# EasyEDA Pro project ProPrj_cap banks_2026-02-15.epro, board PCB1_2
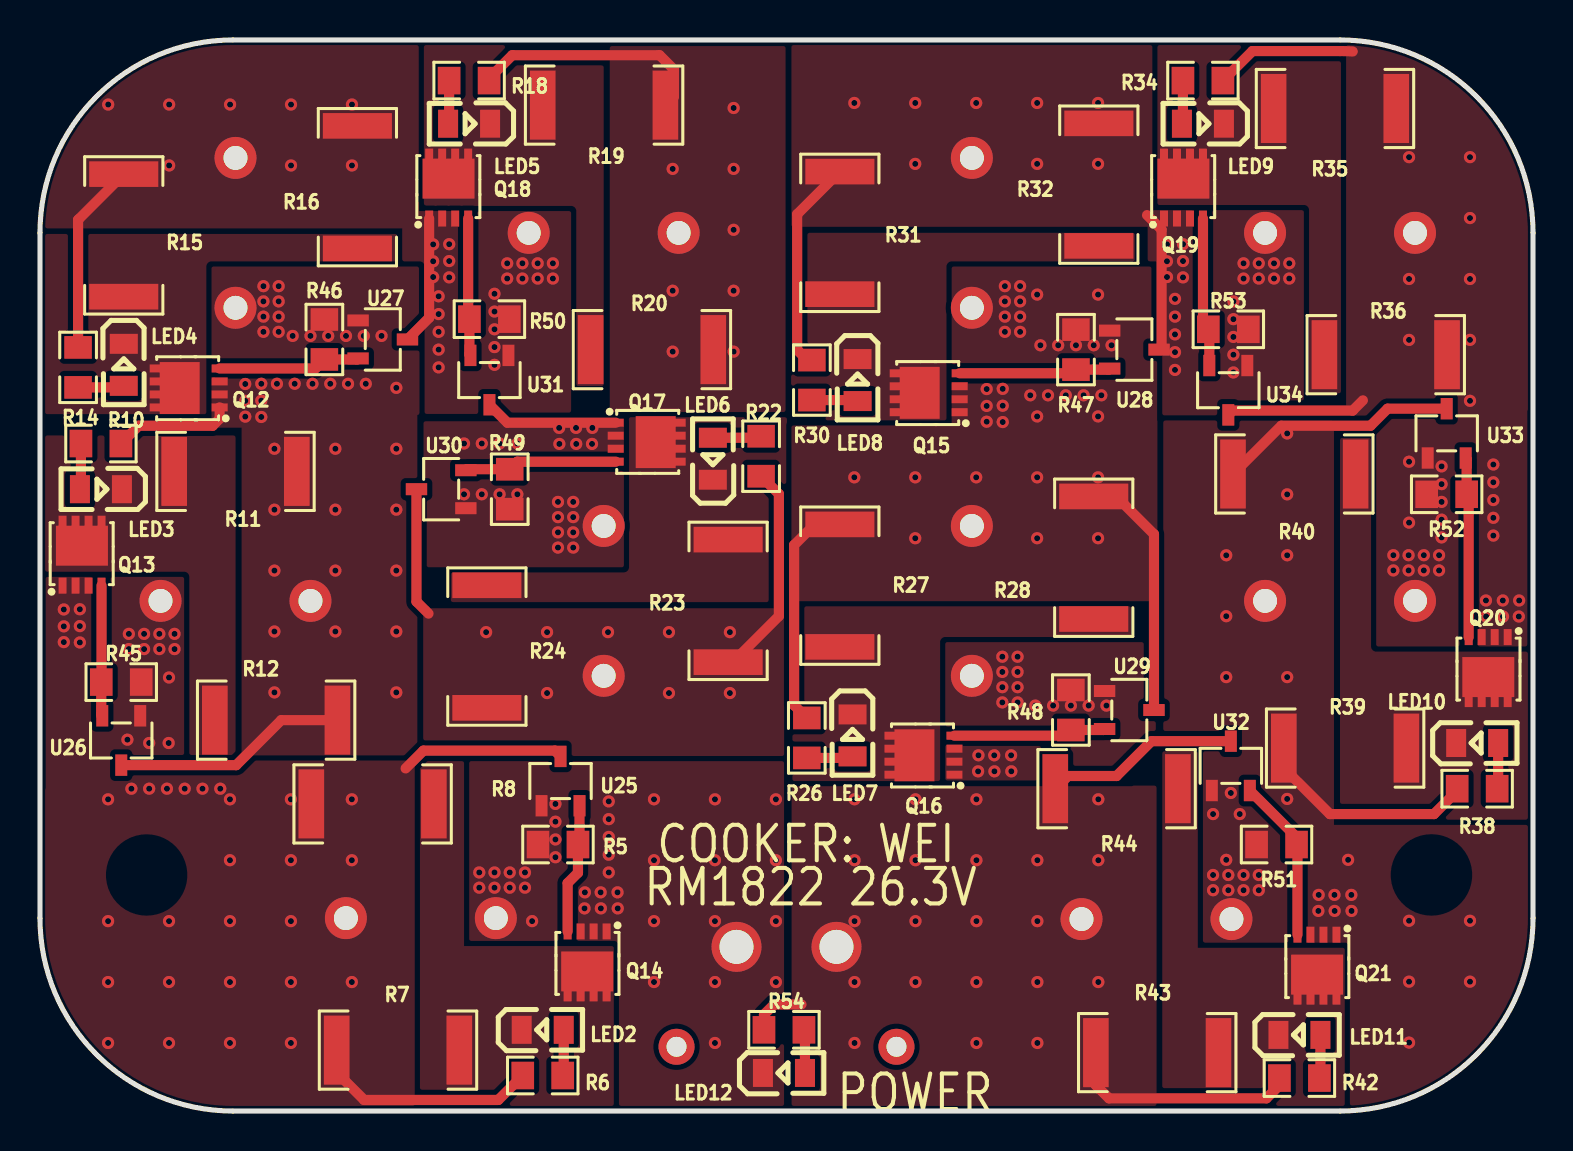
[diagram p8: board, top side]
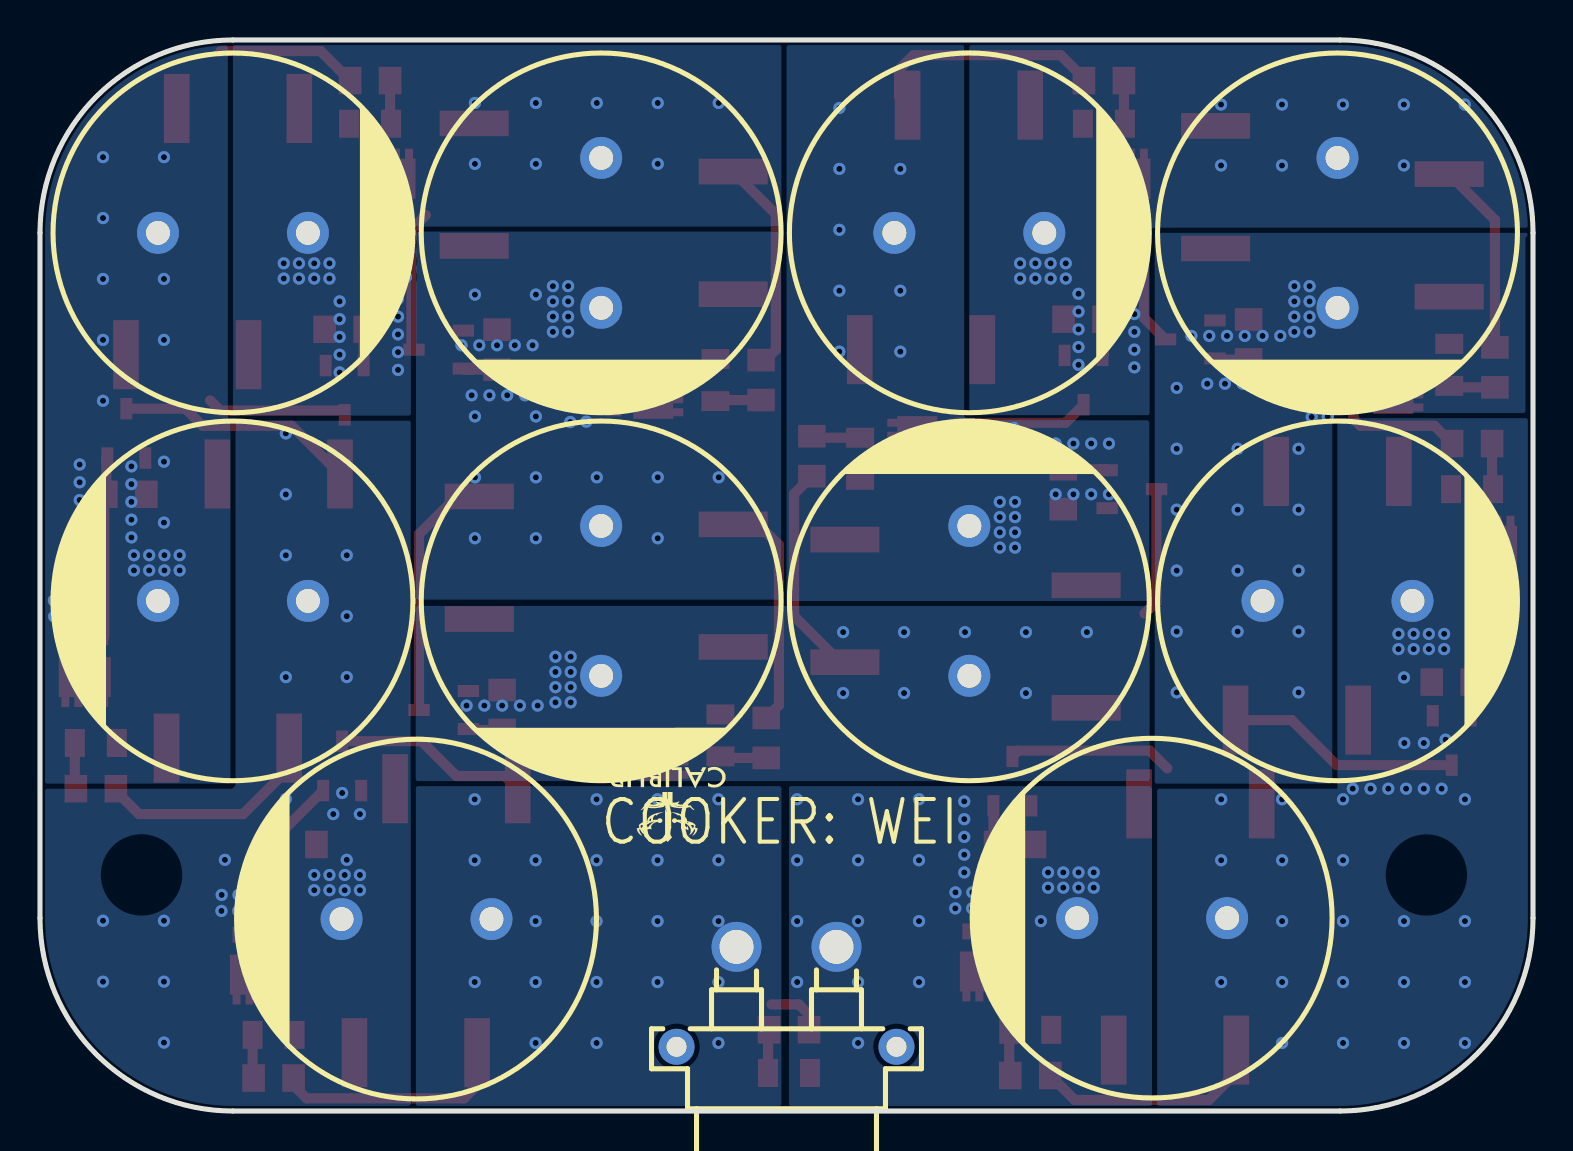
[diagram p9: board, bottom side, seen from below]

Outline 74.68 x 53.59 mm; copper layers: Top Layer, Bottom Layer. Coordinates in mm from the lower left corner of the outline.
Outline path: 0,43.94 0,9.65 arc(2.83,2.83) 9.65,0 65.02,0 arc(71.85,2.83) 74.68,9.65 74.68,43.94 arc(71.85,50.77) 65.02,53.59 9.65,53.59 arc(2.83,50.77) 0,43.94
Stack: Top Layer 0.035mm / Dielectric1 1.51mm FR4 er 4.5 / Bottom Layer 0.035mm

## Design rules (mm)
template: Custom Config
spacing copperThickness1oz (default): track to track 0.102, other pairs 0.152 to 0.3
spacing copperThickness2oz: track to track 0.203, other pairs 0.152 to 0.3
track width copperThickness1oz (default): min 0.127, default 0.508, max 2.54
track width copperThickness2oz: min 0.203, default 0.254, max 2.54
differential pair differentialPair (default): width min 0.127, default 0.254, max 2.54; gap min 0.152, default 0.152
via viaSize (default): diameter min 0.5, default 0.61, max 10; hole min 0.3, default 0.305, max 6.3
net GND uses copperRegion1
net $1N2021 uses copperRegion1
net $1N2373 uses copperRegion1
net $1N2722 uses copperRegion1
net $1N3071 uses copperRegion1
net $1N3399 uses copperRegion1
net $1N3727 uses copperRegion1
net $1N4055 uses copperRegion1
net $1N4383 uses copperRegion1
net $1N4711 uses copperRegion1
net $1N5039 uses copperRegion1
net $1N3072 uses copperRegion1
net VCC uses copperRegion1
net NET2 uses copperRegion1
net NET3 uses copperRegion1
net NET4 uses copperRegion1
net NET5 uses copperRegion1
net NET6 uses copperRegion1
net NET7 uses copperRegion1
net NET8 uses copperRegion1
net NET9 uses copperRegion1
net NET10 uses copperRegion1

## Placement (name value [footprint] x y rotation side)
LED2  NCD0805R1  [LED0805-R-RD]  25.15 4.06 0 top
LED3  NCD0805R1  [LED0805-R-RD]  3.05 31.11 180 top
LED4  NCD0805R1  [LED0805-R-RD]  4.19 37.34 270 top
LED5  NCD0805R1  [LED0805-R-RD]  21.46 49.4 180 top
LED6  NCD0805R1  [LED0805-R-RD]  33.66 32.64 90 top
LED7  NCD0805R1  [LED0805-R-RD]  40.64 18.8 270 top
LED8  NCD0805R1  [LED0805-R-RD]  40.89 36.58 270 top
LED9  NCD0805R1  [LED0805-R-RD]  58.17 49.4 180 top
LED10  NCD0805R1  [LED0805-R-RD]  71.88 18.41 0 top
LED11  NCD0805R1  [LED0805-R-RD]  62.99 3.81 0 top
LED12  KT-0805G  [LED0805-R-RD]  37.21 1.91 0 top
Q12  AP2045Q  [DFN-8_L3.1-W3.0-P0.65-LS3.3-BL]  7.44 36.18 90 top
Q13  AP2045Q  [DFN-8_L3.1-W3.0-P0.65-LS3.3-BL]  2.1 27.84 0 top
Q14  AP2045Q  [DFN-8_L3.1-W3.0-P0.65-LS3.3-BL]  27.37 7.44 180 top
Q15  AP2045Q  [DFN-8_L3.1-W3.0-P0.65-LS3.3-BL]  44.45 35.94 90 top
Q16  AP2045Q  [DFN-8_L3.1-W3.0-P0.65-LS3.3-BL]  44.19 17.81 90 top
Q17  AP2045Q  [DFN-8_L3.1-W3.0-P0.65-LS3.3-BL]  30.35 33.47 270 top
Q18  AP2045Q  [DFN-8_L3.1-W3.0-P0.65-LS3.3-BL]  20.44 46.21 0 top
Q19  AP2045Q  [DFN-8_L3.1-W3.0-P0.65-LS3.3-BL]  57.19 46.21 0 top
Q20  AP2045Q  [DFN-8_L3.1-W3.0-P0.65-LS3.3-BL]  72.43 22.16 180 top
Q21  AP2045Q  [DFN-8_L3.1-W3.0-P0.65-LS3.3-BL]  63.87 7.28 180 top
R5  30kΩ  [R0805]  25.91 13.33 0 top
R6  100Ω  [R0805]  25.15 1.78 180 top
R7  1Ω  [R2512]  17.91 3.05 180 top
R8  1Ω  [R2512]  16.64 15.37 180 top
R10  100Ω  [R0805]  3.05 33.4 0 top
R11  1Ω  [R2512]  9.78 32.01 0 top
R12  1Ω  [R2512]  11.81 19.56 0 top
R14  100Ω  [R0805]  1.91 37.21 90 top
R15  1Ω  [R2512]  4.19 43.81 90 top
R16  1Ω  [R2512]  15.88 46.23 90 top
R18  100Ω  [R0805]  21.46 51.56 0 top
R19  1Ω  [R2512]  28.21 50.34 0 top
R20  1Ω  [R2512]  30.61 38.1 0 top
R22  100Ω  [R0805]  36.07 32.77 270 top
R23  1Ω  [R2512]  34.42 25.53 270 top
R24  1Ω  [R2512]  22.35 23.24 270 top
R26  100Ω  [R0805]  38.35 18.67 90 top
R27  1Ω  [R2512]  40.01 26.29 90 top
R28  1Ω  [R2512]  52.7 27.69 90 top
R30  100Ω  [R0805]  38.61 36.58 90 top
R31  1Ω  [R2512]  40.01 43.94 90 top
R32  1Ω  [R2512]  52.96 46.35 90 top
R34  100Ω  [R0805]  58.17 51.56 0 top
R35  1Ω  [R2512]  64.77 50.16 0 top
R36  1Ω  [R2512]  67.31 37.85 0 top
R38  100Ω  [R0805]  71.88 16.13 180 top
R39  1Ω  [R2512]  65.28 18.16 180 top
R40  1Ω  [R2512]  62.74 31.88 180 top
R42  100Ω  [R0805]  62.99 1.65 180 top
R43  1Ω  [R2512]  55.88 2.92 180 top
R44  1Ω  [R2512]  53.85 16.13 180 top
R45  30kΩ  [R0805]  4.06 21.46 180 top
R46  30kΩ  [R0805]  14.22 38.61 270 top
R47  30kΩ  [R0805]  51.82 38.1 270 top
R48  30kΩ  [R0805]  51.56 20.07 270 top
R49  30kΩ  [R0805]  23.49 31.11 90 top
R50  30kΩ  [R0805]  22.48 39.62 180 top
R51  30kΩ  [R0805]  61.85 13.33 0 top
R52  30kΩ  [R0805]  70.36 30.86 0 top
R53  30kΩ  [R0805]  59.44 39.12 180 top
R54  30kΩ  [R0805]  37.21 4.06 180 top
U1  XT30PW-F20.G.Y  [CONN-TH_XT30PW-F-1]  37.34 5.71 180 bottom
U5  1500uF  [CAP-TH_BD18.0-P7.50-D0.8-FD]  19.05 9.65 0 bottom
U7  1500uF  [CAP-TH_BD18.0-P7.50-D0.8-FD]  9.78 25.53 180 bottom
U9  1500uF  [CAP-TH_BD18.0-P7.50-D0.8-FD]  9.78 43.94 270 bottom
U11  1500uF  [CAP-TH_BD18.0-P7.50-D0.8-FD]  28.19 43.94 180 bottom
U13  1500uF  [CAP-TH_BD18.0-P7.50-D0.8-FD]  28.19 25.53 90 bottom
U15  1500uF  [CAP-TH_BD18.0-P7.50-D0.8-FD]  46.61 25.53 270 bottom
U17  1500uF  [CAP-TH_BD18.0-P7.50-D0.8-FD]  46.61 43.94 270 bottom
U19  1500uF  [CAP-TH_BD18.0-P7.50-D0.8-FD]  65.02 43.94 180 bottom
U21  1500uF  [CAP-TH_BD18.0-P7.50-D0.8-FD]  65.02 25.53 0 bottom
U23  1500uF  [CAP-TH_BD18.0-P7.50-D0.8-FD]  55.84 9.6 0 bottom
U25  LN809C2641MR-G  [SOT-23-3_L2.9-W1.6-P1.90-LS2.8-BR]  26.04 16.51 270 top
U26  LN809C2641MR-G  [SOT-23-3_L2.9-W1.6-P1.90-LS2.8-BR]  4.06 18.54 90 top
U27  LN809C2641MR-G  [SOT-23-3_L2.9-W1.6-P1.90-LS2.8-BR]  17.14 38.61 180 top
U28  LN809C2641MR-G  [SOT-23-3_L2.9-W1.6-P1.90-LS2.8-BR]  54.74 38.1 180 top
U29  LN809C2641MR-G  [SOT-23-3_L2.9-W1.6-P1.90-LS2.8-BR]  54.48 20.07 180 top
U30  LN809C2641MR-G  [SOT-23-3_L2.9-W1.6-P1.90-LS2.8-BR]  20.07 31.11 0 top
U31  LN809C2641MR-G  [SOT-23-3_L2.9-W1.6-P1.90-LS2.8-BR]  22.48 36.58 90 top
U32  LN809C2641MR-G  [SOT-23-3_L2.9-W1.6-P1.90-LS2.8-BR]  59.56 17.27 270 top
U33  LN809C2641MR-G  [SOT-23-3_L2.9-W1.6-P1.90-LS2.8-BR]  70.36 33.91 270 top
U34  LN809C2641MR-G  [SOT-23-3_L2.9-W1.6-P1.90-LS2.8-BR]  59.44 36.07 90 top

## Footprints (pads in the part's own frame, mm; a bottom-side part is the same pattern mirrored in y, then rotated)
CAP-TH_BD18.0-P7.50-D0.8-FD
  round 2.1 hole 1.2: 1(-3.75,0) 2(3.75,0)
CONN-TH_XT30PW-F-1
  round 2.5 hole 1.7: 1(-2.5,2.5) 2(2.5,2.5)
  round 1.8 hole 1: 3(5.5,-2.5) 4(-5.5,-2.5)
DFN-8_L3.1-W3.0-P0.65-LS3.3-BL
  rect 0.4x0.8 smd: 1(-0.975,-1.55) 2(-0.325,-1.55) 3(0.326,-1.55) 4(0.975,-1.55) 5(0.975,1.55) 6(0.325,1.55) 7(-0.325,1.55) 8(-0.975,1.55)
  rect 2.6x2 smd: 8(-0.004,0.45)
LED0805-R-RD
  rect 1x1.399 smd: 1(1.05,0) 2(-1.05,0)
R0805
  rect 1.133x1.377 smd: 1(-1,0) 2(1,0)
R2512
  rect 1.282x3.456 smd: 1(-3.067,0) 2(3.067,0)
SOT-23-3_L2.9-W1.6-P1.90-LS2.8-BR
  rect 1.07x0.6 smd: 1(1.235,-0.95) 2(1.235,0.95) 3(-1.235,0)

## Nets
As in the schematic.

Pads without a net: U1 3 4

## Via types
v1: diameter 0.61, hole 0.305, Top Layer to Bottom Layer, 366 vias

## Routing (per net, layer and track width the routed paths; a pad name or vN(x,y) marks a point on that pad's centre or on a via; arc(x,y) is an arc through that point)
GND:
  vias: v1(21.97,11.94) v1(21.97,11.18) v1(22.73,11.94) v1(22.73,11.18) v1(23.49,11.94) v1(23.49,11.18) v1(24.26,11.94) v1(24.26,11.18) v1(24.61,9.5) v1(25.78,15.37) v1(25.78,14.48) v1(25.78,13.59) v1(25.78,12.7) v1(27.24,10.14) v1(27.25,10.94) v1(28.04,10.94) v1(28.05,10.14) v1(28.45,15.49) v1(28.45,14.6) v1(28.45,13.72) v1(28.45,12.83) v1(28.45,11.94) v1(28.89,10.94) v1(28.9,10.14) v1(30.71,15.6) v1(30.71,12.55) v1(30.71,9.5) v1(30.71,6.45) v1(33.76,15.6) v1(33.76,12.55) v1(33.76,9.5) v1(33.76,6.45) v1(33.76,3.41) v1(36.81,15.6) v1(36.81,12.55) v1(36.81,9.5) v1(36.81,6.45)
VCC: length 24.3
  Top Layer w0.508: R43.2 52.81,1.29 53.47,0.63 61.34,0.63 61.99,1.29 R42.2 ; 38.08,5.33 36.72,5.33 36.21,4.83 R54.2 ; R44.2 51.42,16.76 53.85,16.76 55.59,18.51 U32.3
  vias: v1(40.74,15.6) v1(40.74,12.55) v1(40.74,9.5) v1(40.74,6.45) v1(40.74,3.41) v1(43.79,15.6) v1(43.79,12.55) v1(43.79,9.5) v1(43.79,6.45) v1(46.84,15.6) v1(46.84,12.55) v1(46.84,9.5) v1(46.84,6.45) v1(46.84,3.41) v1(49.89,12.55) v1(49.89,9.5) v1(49.89,6.45) v1(49.89,3.41) v1(52.93,15.6) v1(52.93,12.55) v1(52.93,6.45)
NET2: length 19.7
  Top Layer w0.508: U25.3 25.75,18.03 19.18,18.03 18.29,17.14 ; R7.2 14.84,1.92 16.21,0.55 22.92,0.55 R6.2
  vias: v1(1.19,25.1) v1(1.19,24.25) v1(1.19,23.46) v1(1.99,25.11) v1(1.99,24.26) v1(1.99,23.45) v1(3.41,15.6) v1(3.41,9.5) v1(3.41,6.45) v1(3.41,3.41) v1(4.37,18.58) v1(4.45,23.88) v1(4.45,23.11) v1(4.57,16.13) v1(5.21,23.88) v1(5.21,23.11) v1(5.46,18.41) v1(5.46,16.13) v1(5.97,23.88) v1(5.97,23.11) v1(6.44,18.41) v1(6.35,16.13) v1(6.45,21.69) v1(6.45,9.5) v1(6.45,6.45) v1(6.45,3.41) v1(6.73,23.88) v1(6.73,23.11) v1(7.24,16.13) v1(8.13,16.13) v1(9.02,16.13) v1(9.5,15.6) v1(9.5,12.55) v1(9.5,9.5) v1(9.5,6.45) v1(9.5,3.41) v1(12.55,15.6) v1(12.55,12.55) v1(12.55,9.5) v1(12.55,6.45) v1(12.55,3.41) v1(15.6,15.6) v1(15.6,12.55) v1(15.6,6.45)
NET3: length 17.8
  Top Layer w0.508: U26.3 9.81,17.31 12.07,19.56 R12.2 ; R10.2 4.94,34.29 8.64,34.29 8.99,34.64 Q12.1
  vias: v1(10.27,36.38) v1(10.27,35.54) v1(10.27,34.75) v1(11.07,36.39) v1(11.07,35.55) v1(11.07,34.73) v1(11.18,41.27) v1(11.18,40.51) v1(11.18,39.75) v1(11.18,38.99) v1(11.73,33.14) v1(11.73,30.09) v1(11.73,27.04) v1(11.73,23.99) v1(11.73,20.95) v1(11.94,41.27) v1(11.94,40.51) v1(11.94,39.75) v1(11.94,38.99) v1(11.85,36.39) v1(12.64,38.79) v1(12.74,36.39) v1(13.53,38.79) v1(13.63,36.39) v1(14.42,38.79) v1(14.52,36.39) v1(14.77,33.14) v1(14.77,30.09) v1(14.77,27.04) v1(14.77,23.99) v1(15.31,38.79) v1(15.41,36.39) v1(16.2,38.79) v1(16.3,36.39) v1(17.08,38.79) v1(17.82,36.19) v1(17.82,33.14) v1(17.82,30.09) v1(17.82,27.04) v1(17.82,23.99) v1(17.82,20.95)
NET4: length 16.1
  Top Layer w0.508: R15.2 1.91,44.6 R14.2 ; U27.3 19.47,39.69 Q18.1
  vias: v1(3.41,50.36) v1(6.46,50.36) v1(6.46,47.32) v1(9.51,50.36) v1(12.56,50.36) v1(12.56,47.32) v1(15.6,50.36) v1(15.6,47.32) v1(19.67,43.36) v1(19.67,42.52) v1(19.67,41.73) v1(19.94,40.77) v1(19.94,39.88) v1(19.94,38.99) v1(19.94,38.1) v1(19.94,37.21) v1(20.47,43.38) v1(20.47,42.53) v1(20.47,41.71) v1(22.73,40.89) v1(22.73,40) v1(22.73,39.12) v1(22.73,38.23) v1(22.73,37.34) v1(23.37,42.42) v1(23.37,41.66) v1(24.13,42.42) v1(24.13,41.66) v1(24.89,42.42) v1(24.89,41.66) v1(25.65,42.42) v1(25.65,41.66)
NET5: length 18.8
  Top Layer w0.508: U31.3 23.38,34.44 Q17.1 ; R19.2 31.71,50.76 31.71,52.11 30.99,52.83 23.62,52.83 22.46,51.67 R18.2
  vias: v1(21.21,33.4) v1(21.21,30.86) v1(22.1,33.4) v1(22.1,30.86) v1(22.99,33.4) v1(22.99,30.86) v1(23.88,33.4) v1(23.88,30.86) v1(25.91,30.48) v1(25.91,29.72) v1(25.91,28.96) v1(25.91,28.19) v1(25.97,34.18) v1(25.98,33.38) v1(26.67,30.48) v1(26.67,29.72) v1(26.67,28.96) v1(26.67,28.19) v1(26.81,34.18) v1(26.82,33.38) v1(27.63,34.18) v1(27.61,33.38) v1(31.65,47.14) v1(31.65,41.05) v1(31.65,38) v1(34.69,50.19) v1(34.69,47.14) v1(34.69,44.09) v1(34.69,41.05) v1(34.69,38)
NET6: length 17.3
  Top Layer w0.508: 19.43,24.89 18.83,25.49 U30.3 ; R22.2 36.96,30.88 36.96,24.77 34.65,22.46 R23.2
  vias: v1(22.31,23.96) v1(25.36,23.96) v1(25.36,20.91) v1(28.41,23.96) v1(31.46,23.96) v1(31.46,20.91) v1(34.51,23.96) v1(34.51,20.91) v1(46.94,17.8) v1(46.92,17) v1(47.73,17.8) v1(47.74,17) v1(48.13,22.73) v1(48.13,21.97) v1(48.13,21.21) v1(48.13,20.45) v1(48.57,17.8) v1(48.58,17) v1(48.89,22.73) v1(48.89,21.97) v1(48.89,21.21) v1(48.89,20.45) v1(49.78,20.29) v1(50.67,20.29) v1(51.56,20.29) v1(52.45,20.29) v1(53.34,20.29)
NET7: length 24.2
  Top Layer w0.508: R27.2 38.75,29.36 37.72,28.32 37.72,20.3 R26.2 ; U29.3 55.72,28.86 53.83,30.75 R28.2
  vias: v1(40.73,31.71) v1(43.78,31.71) v1(43.78,28.66) v1(46.83,31.71) v1(47.35,36.13) v1(47.35,35.28) v1(47.35,34.49) v1(48.15,36.14) v1(48.15,35.29) v1(48.15,34.48) v1(48.26,41.27) v1(48.26,40.51) v1(48.26,39.75) v1(48.26,38.99) v1(49.02,41.27) v1(49.02,40.51) v1(49.02,39.75) v1(49.02,38.99) v1(49.53,35.81) v1(49.87,40.85) v1(49.87,34.76) v1(49.87,31.71) v1(49.87,28.66) v1(50.04,38.32) v1(50.42,35.81) v1(50.93,38.32) v1(51.31,35.81) v1(51.82,38.32) v1(52.2,35.81) v1(52.7,38.32) v1(52.92,40.85) v1(52.92,34.76) v1(52.92,31.71) v1(52.92,28.66) v1(53.09,35.81) v1(53.59,38.32)
NET8: length 17.8
  Top Layer w0.508: U28.3 56.1,38.23 56.1,44.1 55.37,44.83 ; R31.2 37.87,44.87 37.87,38.08 38.38,37.58 R30.2
  vias: v1(40.73,50.44) v1(43.78,50.44) v1(43.78,47.39) v1(46.83,50.44) v1(49.87,50.44) v1(49.87,47.39) v1(52.92,50.44) v1(52.92,47.39) v1(56.37,43.36) v1(56.37,42.52) v1(56.37,41.73) v1(56.77,40.64) v1(56.77,39.75) v1(56.77,38.86) v1(56.77,37.97) v1(56.77,37.08) v1(57.17,43.38) v1(57.17,42.53) v1(57.17,41.71) v1(59.69,40.51) v1(59.69,39.62) v1(59.69,38.73) v1(59.69,37.85) v1(59.69,36.96) v1(60.2,42.42) v1(60.2,41.66) v1(60.96,42.42) v1(60.96,41.66) v1(61.72,42.42) v1(61.72,41.66) v1(62.48,42.42) v1(62.48,41.66)
NET9: length 14.1
  Top Layer w0.508: U34.3 59.66,35.05 65.66,35.05 66.17,35.56 ; R34.2 60.64,53.04 65.02,53.04 arc(65.34,53.03) 65.66,53.02
  vias: v1(67.69,27.81) v1(67.69,27.05) v1(68.48,47.73) v1(68.48,41.63) v1(68.48,38.59) v1(68.48,32.49) v1(68.48,29.44) v1(68.45,27.81) v1(68.45,27.05) v1(69.21,27.81) v1(69.21,27.05) v1(69.98,27.81) v1(69.98,27.05) v1(70.1,32.26) v1(70.1,31.37) v1(70.1,30.48) v1(70.1,29.59) v1(70.1,28.7) v1(71.52,47.73) v1(71.52,44.68) v1(71.52,41.63) v1(71.52,38.59) v1(71.52,35.54) v1(72.32,25.55) v1(72.33,24.74) v1(72.69,32.35) v1(72.69,31.46) v1(72.69,30.57) v1(72.69,29.68) v1(72.69,28.79) v1(73.17,25.55) v1(73.18,24.74) v1(73.98,25.55) v1(73.97,24.74)
NET10: length 23.3
  Top Layer w0.508: R40.2 62.08,34.29 66.55,34.29 67.4,35.14 U33.3 ; R39.2 62.21,17.16 64.52,14.86 69.72,14.86 70.88,16.02 R38.2
  vias: v1(58.67,14.86) v1(58.67,11.81) v1(58.67,11.05) v1(59.33,27.81) v1(59.33,24.76) v1(59.33,21.71) v1(59.33,12.57) v1(59.44,11.81) v1(59.44,11.05) v1(59.56,15.91) v1(60.01,14.86) v1(60.2,11.81) v1(60.2,11.05) v1(60.96,11.81) v1(60.96,11.05) v1(62.38,33.91) v1(62.38,30.86) v1(62.38,27.81) v1(62.38,21.71) v1(62.38,15.62) v1(63.94,10.01) v1(63.96,10.81) v1(64.75,10.81) v1(64.76,10.01) v1(65.43,12.57) v1(65.59,10.81) v1(65.6,10.01) v1(68.48,9.52) v1(68.48,6.47) v1(68.48,3.42) v1(71.52,9.52) v1(71.52,6.47)
$1N2020: length 2.3
  Top Layer w0.508: LED2.1 26.2,1.83 R6.1
$1N2372: length 2.3
  Top Layer w0.508: R10.1 2.05,31.17 LED3.1
$1N2721: length 2.3
  Top Layer w0.508: R14.1 4.11,36.21 LED4.1
$1N2723: length 7.1
  Top Layer w0.508: U27.2 15.86,37.61 R46.2 13.77,37.16 Q12.4
$1N3070: length 2.2
  Top Layer w0.508: LED5.1 20.46,49.45 R18.1
$1N3072: length 6.9
  Top Layer w0.508: Q18.4 21.42,39.69 R50.2 21.48,37.86 U31.2
$1N3398: length 2.4
  Top Layer w0.508: LED6.1 35.99,33.69 R22.1
$1N3400: length 7.7
  Top Layer w0.508: U30.2 21.35,32.11 R49.2 23.87,32.49 Q17.4
$1N3726: length 2.3
  Top Layer w0.508: LED7.1 40.56,17.67 R26.1
$1N3728: length 7.6
  Top Layer w0.508: Q16.4 51.28,18.78 R48.2 53.2,19.07 U29.2
$1N4054: length 2.3
  Top Layer w0.508: LED8.1 40.84,35.58 R30.1
$1N4056: length 7.6
  Top Layer w0.508: Q15.4 51.63,36.92 R47.2 53.45,37.1 U28.2
$1N4382: length 2.2
  Top Layer w0.508: LED9.1 57.17,49.45 R34.1
$1N4384: length 7.5
  Top Layer w0.508: U34.2 58.49,39.07 R53.2 58.17,39.38 Q19.4
$1N4710: length 2.3
  Top Layer w0.508: R38.1 72.93,16.18 LED10.1
$1N4712: length 9
  Top Layer w0.508: U33.2 71.36,32.62 R52.2 71.46,30.76 Q20.4
$1N5038: length 2.2
  Top Layer w0.508: R42.1 64.04,1.7 LED11.1
$1N5040: length 8.2
  Top Layer w0.508: Q21.4 62.9,13.29 R51.2 62.85,13.7 U32.2
$1N23007: length 6.5
  Top Layer w0.508: U25.2 26.98,13.41 R5.2 26.91,11.92 26.39,11.41 Q14.4
$1N23234: length 6.5
  Top Layer w0.508: Q13.4 3.08,21.48 R45.2 3.06,19.83 U26.2
$1N24721: length 2.2
  Top Layer w0.508: LED12.1 38.26,4.01 R54.1

## Copper pours and planes (outline as drawn; the poured copper is in the pictures)
GND on Top Layer: 19.05,17.53 37.21,17.53 37.21,-0.13 22.35,-0.13 22.35,-0.22 19.05,-0.22
GND on Bottom Layer: 18.76,16.27 37.21,16.27 37.21,-0.38 18.76,-0.38
VCC on Top Layer: 37.59,16.38 55.84,16.38 55.84,-0.61 37.59,-0.61
VCC on Bottom Layer: 37.59,16.26 55.88,16.26 55.88,-0.38 37.59,-0.38
NET2 on Top Layer: 7.21,26.73 7.21,17.54 18.74,17.54 18.74,-0.02 0.18,-0.02 0.18,16.14 0.28,16.14 0.28,26.73
NET2 on Bottom Layer: 18.8,16.13 18.8,0.13 0.25,0.13 0.25,34.67 9.78,34.67 9.78,16.13
NET3 on Top Layer: 18.98,34.83 18.87,34.83 18.87,17.58 10.08,17.58 10.08,34.19 8.58,34.19 8.58,42.26 18.98,42.26
NET3 on Bottom Layer: 18.92,16.38 18.92,43.94 0.13,43.94 0.38,43.69 0.38,34.67 9.91,34.67 9.91,16.34 18.88,16.34
NET4 on Top Layer: 18.11,45.03 26.56,45.03 26.56,34.88 18.11,34.88
NET4 on Top Layer: 0.25,53.34 18.95,53.34 18.95,44.17 0.25,44.17
NET4 on Bottom Layer: 0.25,43.94 0.25,54.48 27.69,54.48 28.19,53.97 28.19,34.82 19.18,34.82 19.18,44.07 0.38,44.07
NET5 on Top Layer: 19.18,27.21 19.18,34.51 29.21,34.51 29.21,27.21
NET5 on Top Layer: 28.5,34.98 28.5,53.29 37.29,53.29 37.29,34.98
NET5 on Bottom Layer: 28.32,53.34 37.34,53.34 37.34,25.53 19.19,25.53 19.19,34.65 19.18,34.67 28.32,43.81
NET6 on Top Layer: 45.28,16.54 45.28,23.46 55.81,23.46 55.81,16.54
NET6 on Top Layer: 37.22,17.77 19.17,17.77 19.17,25.16 37.22,25.16
NET6 on Bottom Layer: 19.05,25.27 55.88,25.27 55.88,16.51 19.05,16.51
NET7 on Top Layer: 55.88,42.26 55.88,34.56 55.89,34.56 55.89,25.51 37.58,25.51 37.58,34.3 45.6,34.3 45.6,42.26
NET7 on Bottom Layer: 37.6,44.01 55.87,44.01 55.87,25.59 37.6,25.59
NET8 on Top Layer: 55.4,45.08 63.22,45.08 63.22,34.67 55.4,34.67
NET8 on Top Layer: 55.64,44.24 37.58,44.24 37.58,53.42 55.64,53.42
NET8 on Bottom Layer: 65.02,53.34 65.02,34.8 56.01,34.8 56.01,43.94 37.59,43.94 37.46,44.07 37.46,53.34
NET9 on Top Layer: 74.5,35.04 74.39,35.04 74.39,23.24 66.83,23.24 66.83,34.02 65.33,34.02 65.33,53.35 74.5,53.35
NET9 on Bottom Layer: 65.15,53.34 74.42,53.34 74.42,16.38 65.15,16.38
NET10 on Top Layer: 64.72,34.56 64.72,14.32 75.56,14.32 75.56,-0.86 56.18,-0.86 56.18,34.56
NET10 on Bottom Layer: 56.13,34.67 74.55,34.67 74.55,0 56.13,0
$1N2021 on Top Layer: 28.7,8.25 28.7,-0.38 18.92,-0.38 18.92,17.53 21.21,17.53 21.21,8.25
$1N2373 on Top Layer: 0.25,33.81 9.78,33.81 9.78,17.76 0.25,17.76
$1N2722 on Top Layer: 0.23,34.87 0.23,43.89 17.93,43.89 17.93,34.87
$1N3071 on Top Layer: 19.18,53.34 28.19,53.34 28.19,36.27 19.18,36.27
$1N3399 on Top Layer: 20.55,25.46 20.55,34.86 37.36,34.86 37.36,25.46
$1N3727 on Top Layer: 37.63,16.51 37.63,25.27 54.57,25.27 54.57,16.51
$1N4055 on Top Layer: 37.57,34.54 37.57,43.94 54.76,43.94 54.76,34.54
$1N4383 on Top Layer: 55.88,53.49 65.15,53.49 65.15,35.92 55.88,35.92
$1N4711 on Top Layer: 65.02,33.68 74.42,33.68 74.42,14.58 65.02,14.58
$1N5039 on Top Layer: 65.26,8.17 65.26,-1.02 56.13,-1.02 56.13,18.03 57.91,18.03 57.91,8.17

## Text on the board
Bottom Silkscreen Layer: COOKER: WEI
Top Silkscreen Layer: RM1822 26.3V | COOKER: WEI | POWER
